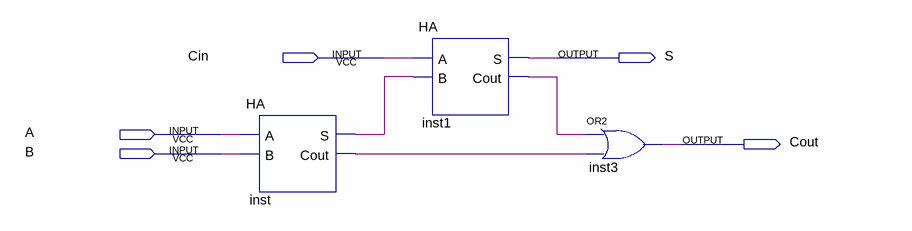
[diagram p0: schematic sheet]
// Quartus schematic FA.bdf as structural Verilog: 3 symbols, 5 pins
module FA (
  input  Cin,
  input  A,
  input  B,
  output S,
  output Cout
);

  wire inst1_cout, inst_cout, inst_s;

  HA inst (.A(A), .B(B), .S(inst_s), .Cout(inst_cout));
  HA inst1 (.A(Cin), .B(inst_s), .S(S), .Cout(inst1_cout));
  or inst3 (Cout, inst1_cout, inst_cout);
endmodule
